# EAGLE design pimagic4 (EAGLE 7.1.0)
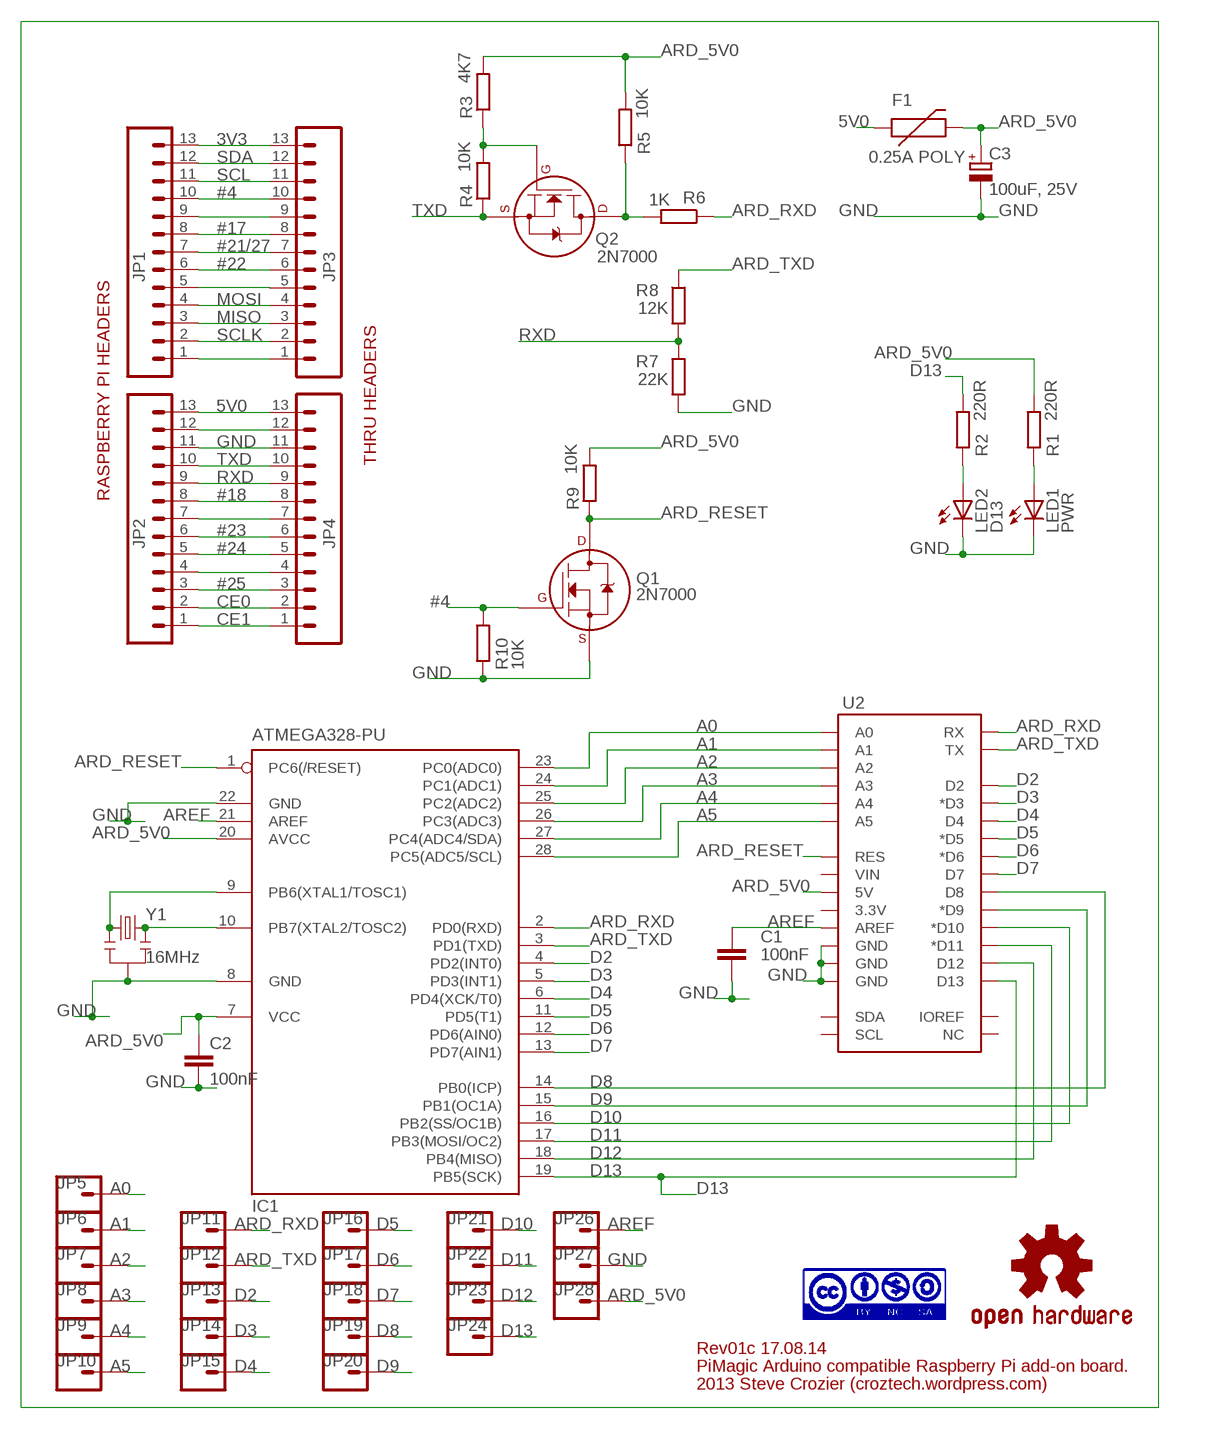
[diagram p0: schematic, sheet 1]

## Parts
C1  100nF  C5/2.5  [C5B2.5]
C2  100nF  C5/2.5  [C5B2.5]
C3  100uF, 25V  CPOL-EUE2.5-6  [E2,5-6]
F1  0.25A POLY  PTCPTH  [PTC]
IC1  ATMEGA328-PU  MEGA8-P  [DIL28-3]
JP1  M13  [1X13]
JP2  M13  [1X13]
JP3  M13  [1X13]
JP4  M13  [1X13]
JP5  M01PTH  [1X01]
JP6  M01PTH  [1X01]
JP7  M01PTH  [1X01]
JP8  M01PTH  [1X01]
JP9  M01PTH  [1X01]
JP10  M01PTH  [1X01]
JP11  M01PTH  [1X01]
JP12  M01PTH  [1X01]
JP13  M01PTH  [1X01]
JP14  M01PTH  [1X01]
JP15  M01PTH  [1X01]
JP16  M01PTH  [1X01]
JP17  M01PTH  [1X01]
JP18  M01PTH  [1X01]
JP19  M01PTH  [1X01]
JP20  M01PTH  [1X01]
JP21  M01PTH  [1X01]
JP22  M01PTH  [1X01]
JP23  M01PTH  [1X01]
JP24  M01PTH  [1X01]
JP26  M01PTH  [1X01]
JP27  M01PTH  [1X01]
JP28  M01PTH  [1X01]
LED1  PWR  LED3MM  [LED3MM]
LED2  D13  LED3MM  [LED3MM]
Q1  2N7000  2N7000_TO92  [TO-92]
Q2  2N7000  2N7000_TO92  [TO-92]
R1  220R  R-EU_0207/10  [0207/10]
R2  220R  R-EU_0207/10  [0207/10]
R3  4K7  R-EU_0207/10  [0207/10]
R4  10K  R-EU_0207/10  [0207/10]
R5  10K  R-EU_0207/10  [0207/10]
R6  1K  R-EU_0207/10  [0207/10]
R7  22K  R-EU_0207/10  [0207/10]
R8  12K  R-EU_0207/10  [0207/10]
R9  10K  R-EU_0207/10  [0207/10]
R10  10K  R-EU_0207/10  [0207/10]
U2  ARDUINO_SHIELDLONGPADS  [DUEMILANOVE_SHIELD_LONGPADS]
U$1  OSHW-LOGOM  [OSHW-LOGO-M]
Y1  16MHz  RESONATORPTH  [RESONATOR-PTH]

## Nets
3V3: JP1.13 JP3.13
5V0: F1.P$1 JP2.13 JP4.13
#4: JP1.10 JP3.10 Q1.2(G) R10.2
#17: JP1.8 JP3.8
#18: JP2.8 JP4.8
#21/27: JP1.7 JP3.7
#22: JP1.6 JP3.6
#23: JP2.6 JP4.6
#24: JP2.5 JP4.5
#25: JP2.3 JP4.3
A0: IC1.23(PC0(ADC0)) JP5.1 U2.A0
A1: IC1.24(PC1(ADC1)) JP6.1 U2.A1
A2: IC1.25(PC2(ADC2)) JP7.1 U2.A2
A3: IC1.26(PC3(ADC3)) JP8.1 U2.A3
A4: IC1.27(PC4(ADC4/SDA)) JP9.1 U2.A4
A5: IC1.28(PC5(ADC5/SCL)) JP10.1 U2.A5
ARD_5V0: C2.1 C3.+ F1.P$2 IC1.7(VCC) IC1.20(AVCC) JP28.1 R1.2 R3.2 R5.2 R9.2 U2.5V
ARD_RESET: IC1.1(PC6(/RESET)) Q1.3(D) R9.1 U2.RES
ARD_RXD: IC1.2(PD0(RXD)) JP11.1 R6.1 U2.RX
ARD_TXD: IC1.3(PD1(TXD)) JP12.1 R8.1 U2.TX
AREF: C1.1 IC1.21(AREF) JP26.1 U2.AREF
CE0: JP2.2 JP4.2
CE1: JP2.1 JP4.1
D2: IC1.4(PD2(INT0)) JP13.1 U2.D2
D3: IC1.5(PD3(INT1)) JP14.1 U2.D3(*D3)
D4: IC1.6(PD4(XCK/T0)) JP15.1 U2.D4
D5: IC1.11(PD5(T1)) JP16.1 U2.D5(*D5)
D6: IC1.12(PD6(AIN0)) JP17.1 U2.D6(*D6)
D7: IC1.13(PD7(AIN1)) JP18.1 U2.D7
D8: IC1.14(PB0(ICP)) JP19.1 U2.D8
D9: IC1.15(PB1(OC1A)) JP20.1 U2.D9(*D9)
D10: IC1.16(PB2(SS/OC1B)) JP21.1 U2.D10(*D10)
D11: IC1.17(PB3(MOSI/OC2)) JP22.1 U2.D11(*D11)
D12: IC1.18(PB4(MISO)) JP23.1 U2.D12
D13: IC1.19(PB5(SCK)) JP24.1 R2.2 U2.D13
GND: C1.2 C2.2 C3.- IC1.8(GND) IC1.22(GND) JP2.11 JP4.11 JP27.1 LED1.K(C) LED2.K(C) Q1.1(S) R7.2 R10.1 U2.GND@0(GND) U2.GND@1(GND) U2.GND@2(GND) Y1.2
MISO: JP1.3 JP3.3
MOSI: JP1.4 JP3.4
N$1: JP1.5 JP3.5
N$2: JP1.1 JP3.1
N$3: Q2.2(G) R3.1 R4.2
N$4: IC1.9(PB6(XTAL1/TOSC1)) Y1.1
N$5: JP1.9 JP3.9
N$6: IC1.10(PB7(XTAL2/TOSC2)) Y1.3
N$7: Q2.3(D) R5.1 R6.2
N$10: LED2.A R2.1
N$12: LED1.A R1.1
N$15: JP2.12 JP4.12
N$20: JP2.7 JP4.7
N$23: JP2.4 JP4.4
RXD: JP2.9 JP4.9 R7.1 R8.2
SCL: JP1.11 JP3.11
SCLK: JP1.2 JP3.2
SDA: JP1.12 JP3.12
TXD: JP2.10 JP4.10 Q2.1(S) R4.1
Unconnected: U2.3.3V U2.IOREF U2.NC U2.SCL U2.SDA U2.VIN

## Notes on the sheet
- THRU HEADERS
- RASPBERRY PI HEADERS
- Rev01c 17.08.14
- PiMagic Arduino compatible Raspberry Pi add-on board.
- 2013 Steve Crozier (croztech.wordpress.com)

## Library data of the parts
C1 C2 = capacitor-wima:C: CAPACITOR naming: grid - package width
C3 = resistor:CPOL-EU: POLARIZED CAPACITOR, European symbol
F1 = SparkFun:PTC: Resettable Fuse PTC Resettable Fuse. Spark Fun Electronics SKU : COM-08357
IC1 = atmel:MEGA8-P: MICROCONTROLLER 8 Kbytes FLASH, 1 kbytes SRAM, 512 bytes EEPROM, USART, 4-channel 10 bit ADC, 2-channel 8 bit ADC Pin compatible with Atmega48, ATMega88, ATMega168 Source: avr.lbr; OC_FARNELL: unknown; OC_NEWARK: unknown
JP1-JP4 = SparkFun:M13
JP5-JP24 JP26-JP28 = Steve01:M01: Header 1 Standard 1-pin 0.1" header. Use with straight break away headers (SKU : PRT-00116), right angle break away headers (PRT-00553), swiss pins (PRT-00743), machine pins (PRT-00117), and female headers (PRT-00115).
LED1 LED2 = SparkFun:LED: LEDs Standard schematic elements and footprints for 5mm, 3mm, 1206, and 0603 sized LEDs. 5mm - Spark Fun Electronics SKU : COM-00529 (and others)
Q1 Q2 = transistors:2N700*: 2N7000, 2N7002, NDS7002A N-channel enhancement mode MOSFET
R1-R10 = resistor:R-EU_: RESISTOR, European symbol
U2 = Steve01:ARDUINO_SHIELD: Steve's arduino shield layout: - external legends so internal second pads can be added, - long pads, added unused terminals
U$1 = SparkFun:OSHW-LOGO: Open Source Hardware Logo This logo indicates the piece of hardware it is found on incorporates a OSHW license and/or adheres to the definition of open source hardware found here: http://freedomdefined.org/OSHW
Y1 = SparkFun:RESONATOR: Resonator Small SMD resonator. This is the itty bitty 10/20MHz resonators with built in caps. CSTCE10M0G55 and CSTCE20M0V53. Footprint has been reviewed closely but hasn't been tested yet.

## Board
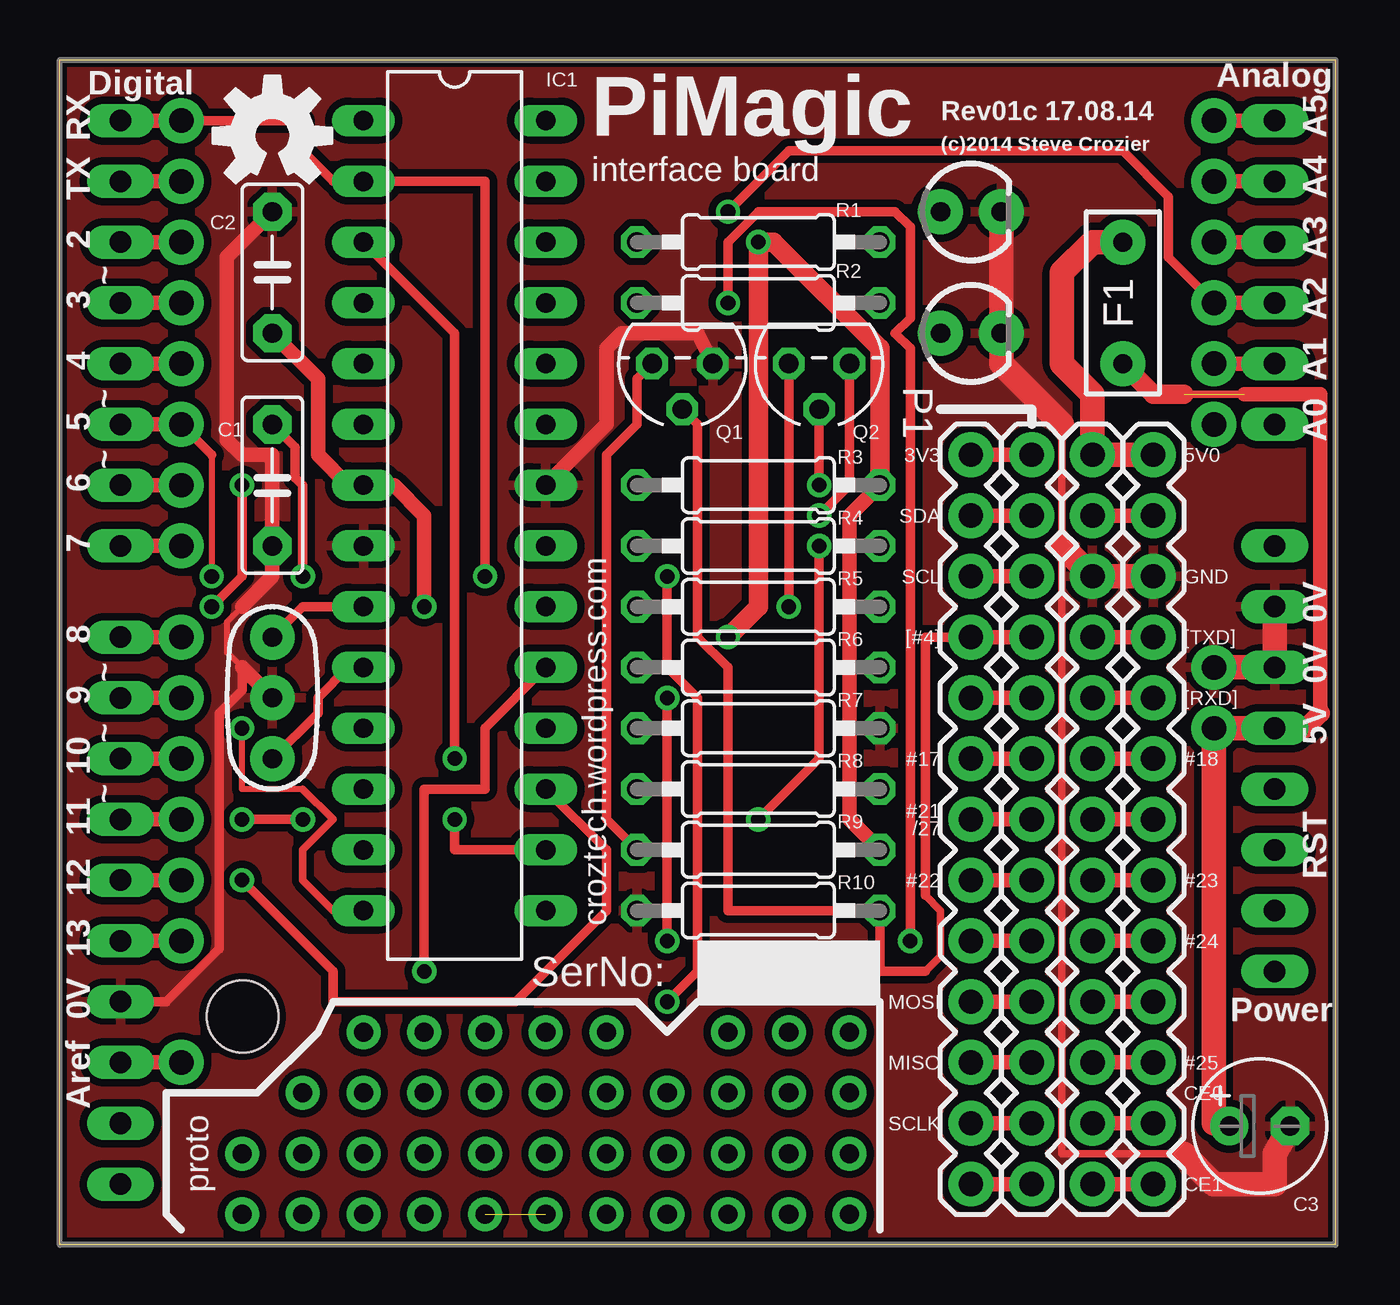
[diagram p1: board, top side]
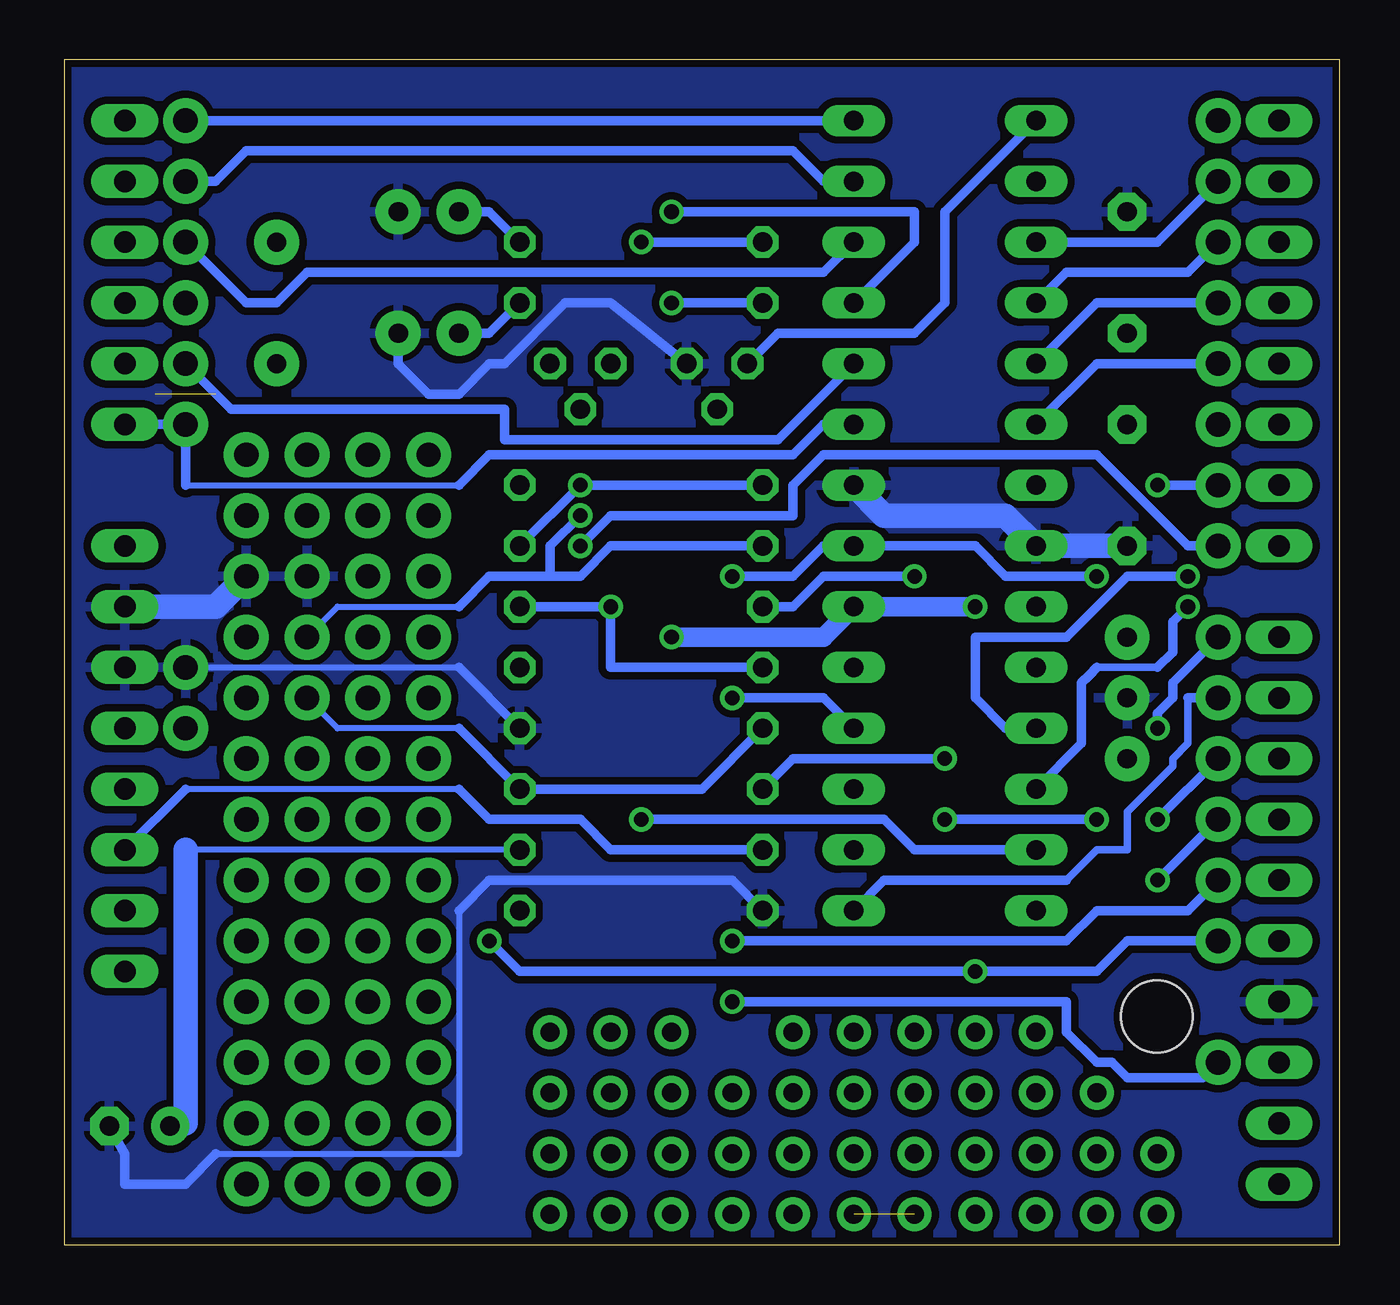
[diagram p2: board, bottom side, seen from below]

Size 53.34 x 49.53 mm. Coordinates in mm from the lower left corner, seen from the top.
Outline: 0,49.53 53.34,49.53 53.34,0 0,0 0,49.53
Copper layers (1*16): Top 0.035mm / dielectric 1.5mm / Bottom 0.035mm
Design rules "default *": minimum track width 6mil, minimum drill 20mil, track to track 6mil, track to pad 6mil, pad to pad 6mil, via to via 6mil, smd to smd 6mil, copper to edge 6mil, drill to drill 6mil, minimum pad ring 10mil, minimum via ring 8mil, stop-mask expansion 4mil, vias tented up to drill 0mil, thermal gap 10mil
Holes 3 mm at 7.64,9.54

### Footprints (pad centres in the part's own frame; a part is rotated, then mirrored left to right if it is on the bottom)
C5B2.5 = drill 0.813 pad 1.6 octagon: 1 -2.54,0; 2 2.54,0
E2,5-6 = drill 0.813 pad 1.6: + -1.27,0 | drill 0.813 pad 1.6 octagon: - 1.27,0
PTC = drill 0.8 pad 1.88: P$1 -2.54,0; P$2 2.54,0
DIL28-3 = drill 0.813 long: 1 -16.51,-3.81; 2 -13.97,-3.81; 3 -11.43,-3.81; 4 -8.89,-3.81; 5 -6.35,-3.81; 6 -3.81,-3.81; 7 -1.27,-3.81; 8 1.27,-3.81; 9 3.81,-3.81; 10 6.35,-3.81; 11 8.89,-3.81; 12 11.43,-3.81; 13 13.97,-3.81; 14 16.51,-3.81; 15 16.51,3.81; 16 13.97,3.81; 17 11.43,3.81; 18 8.89,3.81; 19 6.35,3.81; 20 3.81,3.81; 21 1.27,3.81; 22 -1.27,3.81; 23 -3.81,3.81; 24 -6.35,3.81; 25 -8.89,3.81; 26 -11.43,3.81; 27 -13.97,3.81; 28 -16.51,3.81
1X13 = drill 1.016 pad 1.88: 1 0,0; 2 2.54,0; 3 5.08,0; 4 7.62,0; 5 10.16,0; 6 12.7,0; 7 15.24,0; 8 17.78,0; 9 20.32,0; 10 22.86,0; 11 25.4,0; 12 27.94,0; 13 30.48,0
1X01 = drill 1.016 pad 1.88: 1 0,0
LED3MM = drill 0.813 pad 1.88: A -1.27,0; K 1.27,0
TO-92 = drill 0.813 octagon: 1 -1.27,0; 2 0,1.905; 3 1.27,0
0207/10 = drill 0.813 octagon: 1 -5.08,0; 2 5.08,0
DUEMILANOVE_SHIELD_LONGPADS = drill 0.9 pad 1.27 long: 3.3V 50.8,26.67; 5V 50.8,29.21; A0 50.8,41.91; A1 50.8,44.45; A2 50.8,46.99; A3 50.8,49.53; A4 50.8,52.07; A5 50.8,54.61; AREF 2.54,15.24; D2 2.54,49.53; D3 2.54,46.99; D4 2.54,44.45; D5 2.54,41.91; D6 2.54,39.37; D7 2.54,36.83; D8 2.54,33.02; D9 2.54,30.48; D10 2.54,27.94; D11 2.54,25.4; D12 2.54,22.86; D13 2.54,20.32; GND@0 50.8,31.75; GND@1 50.8,34.29; GND@2 2.54,17.78; IOREF 50.8,21.59; NC 50.8,19.05; RES 50.8,24.13; RX 2.54,54.61; SCL 2.54,10.16; SDA 2.54,12.7; TX 2.54,52.07; VIN 50.8,36.83
RESONATOR-PTH = drill 0.8 pad 1.88: 1 -2.54,0; 2 0,0; 3 2.54,0

### Placement (x,y rotation side)
C1  8.89,31.75 270 top
C2  8.89,40.64 90 top
C3  50.17,4.96 0 top
F1  44.45,39.37 270 top
IC1  16.51,30.48 270 top
JP1  40.64,2.54 90 top
JP2  43.18,2.54 90 top
JP3  38.1,2.54 90 top
JP4  45.72,2.54 90 top
JP5  48.26,34.29 0 top
JP6  48.26,36.83 0 top
JP7  48.26,39.37 0 bottom
JP8  48.26,41.91 0 top
JP9  48.26,44.45 0 top
JP10  48.26,46.99 0 top
JP11  5.08,46.99 0 top
JP12  5.08,44.45 0 top
JP13  5.08,41.91 0 top
JP14  5.08,39.37 0 top
JP15  5.08,36.83 0 top
JP16  5.08,34.29 0 top
JP17  5.08,31.75 0 top
JP18  5.08,29.21 0 top
JP19  5.08,25.4 0 top
JP20  5.08,22.86 0 top
JP21  5.08,20.32 0 top
JP22  5.08,17.78 0 top
JP23  5.08,15.24 0 top
JP24  5.08,12.7 0 top
JP26  5.08,7.62 0 top
JP27  48.26,24.13 0 top
JP28  48.26,21.59 0 top
LED1  38.1,43.18 0 top
LED2  38.1,38.1 0 top
Q1  26.04,36.83 180 top
Q2  31.75,36.83 180 top
R1  29.21,41.91 180 top
R2  29.21,39.37 180 top
R3  29.21,31.75 0 top
R4  29.21,29.21 0 top
R5  29.21,24.13 0 top
R6  29.21,26.67 0 top
R7  29.21,21.59 0 top
R8  29.21,19.05 0 top
R9  29.21,16.51 0 top
R10  29.21,13.97 0 top
U2  0,-7.62 0 top
U$1  8.89,46.35 0 top
Y1  8.89,22.86 270 top

### Tracks (layer width: path | path; a pad name or v marks a point on that pad's centre or on a via)
3V3
  Top 0.61: JP3.13 JP1.13
5V0
  Top 1.016: JP4.13 JP2.13 43.18,35.56 41.91,36.83 41.91,40.64 43.18,41.91 F1.P$1
#4
  Top 0.305: 36.2,11.43 36.83,12.06 36.83,13.97 36.2,14.6
  Top 0.406: 26.67,34.29 26.67,33.02 26.67,25.4 27.94,24.13 27.94,13.97 R10.2 34.29,11.43 36.2,11.43 | 26.67,34.29 Q1.2 26.67,34.29 | 36.2,14.6 36.2,25.4 JP3.10
  Top 0.61: JP1.10 JP3.10
#17
  Top 0.61: JP1.8 JP3.8
#18
  Top 0.61: JP2.8 JP4.8
#21/27
  Top 0.61: JP3.7 JP1.7
#22
  Top 0.61: JP1.6 JP3.6
#23
  Top 0.61: JP2.6 JP4.6
#24
  Top 0.61: JP4.5 JP2.5
#25
  Top 0.61: JP4.3 JP2.3
A0
  Bottom 0.254: 48.26,31.75 36.83,31.75
  Bottom 0.406: IC1.23 21.59,34.29 22.86,33.02 35.56,33.02 36.83,31.75 | 48.26,31.75 JP5.1 U2.A0
A1
  Top 0.61: U2.A1 JP6.1
  Bottom 0.406: IC1.24 23.5,33.66 34.92,33.66 34.92,34.93 46.35,34.93 JP6.1
A2  (via drill 0.61)
  Top 0.406: JP7.1 46.35,41.27 46.35,43.82 44.45,45.72 30.48,45.72 v27.94,43.18
  Top 0.61: U2.A2 JP7.1
  Bottom 0.406: v27.94,43.18 17.78,43.18 17.78,41.91 IC1.25
A3
  Top 0.61: U2.A3 JP8.1
  Bottom 0.406: IC1.26 21.59,40.64 43.18,40.64 44.45,39.37 45.72,39.37 JP8.1
A4
  Top 0.61: U2.A4 JP9.1
  Bottom 0.406: IC1.27 21.59,44.45 22.86,45.72 45.72,45.72 46.99,44.45 JP9.1
A5
  Top 0.61: U2.A5 JP10.1
  Bottom 0.406: IC1.28 JP10.1
ARD_5V0  (via drill 0.61)  (1 unrouted)
  Top 0.305: 46.99,35.56 49.53,35.56
  Top 0.61: C2.1 10.79,36.2 10.79,33.02 12.07,31.75 IC1.7 13.97,31.75 15.24,30.48 v15.24,26.67 | R9.2 33.02,17.78 33.02,24.13 | 33.02,24.13 R5.2 | 33.02,24.13 33.02,30.48 R3.2 | 49.53,35.56 52.7,35.56 52.7,22.23
  Top 0.813: JP28.1 52.07,21.59 52.7,22.23 | F1.P$2 45.72,35.56 46.99,35.56 | v27.94,25.4 29.21,26.67 v29.21,41.91 29.84,41.91 34.29,37.46 R3.2
  Top 1.016: C3.+ 48.26,5.08 JP28.1 U2.5V
  Bottom 0.254: R9.2 48.26,16.51
  Bottom 0.406: R1.2 v29.21,41.91
  Bottom 0.813: v27.94,25.4 21.59,25.4 IC1.20 v15.24,26.67
  Bottom 1.016: 48.26,16.51 48.26,5.08 C3.+
ARD_RESET
  Top 0.406: R9.1 22.86,17.78 22.86,33.02 24.13,34.29 24.13,36.2 Q1.3
  Bottom 0.254: 36.83,19.05 48.26,19.05
  Bottom 0.406: IC1.1 16.51,43.18 16.51,39.37 17.78,38.1 21.59,38.1 23.5,38.1 Q1.3 | 48.26,19.05 U2.RES | 36.83,19.05 35.56,17.78 31.75,17.78 30.48,16.51 R9.1
ARD_RXD  (via drill 0.61)
  Top 0.406: JP11.1 10.16,46.99 10.16,45.72 11.43,44.45 IC1.2 17.78,44.45 v17.78,27.94
  Top 0.61: U2.RX JP11.1
  Bottom 0.406: R6.1 22.86,26.67 21.59,27.94 v17.78,27.94
ARD_TXD  (via drill 0.61)
  Top 0.406: IC1.3 16.51,38.1 v16.51,20.32
  Top 0.61: JP12.1 U2.TX
  Bottom 0.406: JP12.1 7.62,41.91 IC1.3 | v16.51,20.32 22.86,20.32 R8.1
AREF  (via drill 0.61)
  Top 0.406: v25.4,10.16 26.67,11.43 26.67,22.86 25.4,24.13 v25.4,27.94 | C1.1 9.84,33.34 9.84,32.07 10.16,31.75 v10.16,27.94
  Top 0.61: U2.AREF JP26.1
  Bottom 0.406: v25.4,10.16 11.43,10.16 11.43,8.89 10.16,7.62 9.53,7.62 8.89,6.98 5.71,6.98 JP26.1 | v25.4,27.94 22.86,27.94 21.59,29.21 IC1.21 15.24,29.21 13.97,27.94 v10.16,27.94
CE0
  Top 0.61: JP2.2 JP4.2
CE1
  Top 0.61: JP4.1 JP2.1
D2
  Top 0.61: U2.D2 JP13.1
  Bottom 0.406: JP13.1 6.35,40.64 11.43,40.64 IC1.4
D3
  Top 0.61: JP14.1 U2.D3
  Bottom 0.406: JP14.1 10.16,39.37 IC1.5
D4
  Top 0.61: U2.D4 JP15.1
  Bottom 0.406: JP15.1 10.16,36.83 IC1.6
D5  (via drill 0.61)
  Top 0.254: 6.35,33.02 v6.35,27.94
  Top 0.406: 6.35,33.02 JP16.1
  Top 0.61: JP16.1 U2.D5
  Bottom 0.406: v6.35,27.94 8.89,27.94 11.43,25.4 15.24,25.4 15.24,22.86 13.97,21.59 IC1.11
D6  (via drill 0.61)
  Top 0.406: v6.35,26.67 7.62,27.94 v7.62,31.75
  Top 0.61: U2.D6 JP17.1
  Bottom 0.305: 7.62,24.13 10.16,24.13
  Bottom 0.406: JP17.1 v7.62,31.75 | IC1.12 10.79,20.95 10.79,23.49 10.48,23.81 10.16,24.13 | 7.62,24.13 6.99,24.77 6.99,26.03 v6.35,26.67
D7  (via drill 0.61)
  Top 0.406: v29.21,17.78 31.75,20.32 v31.75,29.21
  Top 0.61: JP18.1 U2.D7
  Bottom 0.406: v31.75,29.21 30.48,30.48 22.86,30.48 22.86,31.75 21.59,33.02 10.16,33.02 6.35,29.21 JP18.1 | IC1.13 17.78,16.51 19.05,17.78 v29.21,17.78
D8  (via drill 0.61)
  Top 0.254: 10.16,19.05 7.62,19.05 v7.62,21.59
  Top 0.305: IC1.14 11.43,13.97 10.16,15.24 10.16,16.51 11.43,17.78 10.16,19.05
  Top 0.61: U2.D8 JP19.1
  Bottom 0.406: v7.62,21.59 7.62,22.23 6.99,22.86 6.99,23.49 JP19.1
D9
  Top 0.61: JP20.1 U2.D9
  Bottom 0.305: 6.35,22.86 6.35,20.95 6.99,20.32 6.99,20 8.89,18.1 8.89,16.51 10.16,16.51 11.43,15.24
  Bottom 0.406: IC1.15 19.05,15.24 11.43,15.24 | 6.35,22.86 JP20.1
D10  (via drill 0.61)
  Top 0.406: v16.51,17.78 16.51,16.51 IC1.16 | v7.62,17.78 v10.16,17.78
  Top 0.61: U2.D10 JP21.1
  Bottom 0.406: JP21.1 v7.62,17.78 | v10.16,17.78 v16.51,17.78
D11  (via drill 0.61)
  Top 0.406: IC1.17 22.86,16.51 22.86,13.97 19.05,10.16 11.43,10.16 11.43,11.43 v7.62,15.24
  Top 0.61: JP22.1 U2.D11
  Bottom 0.406: JP22.1 v7.62,15.24
D12  (via drill 0.61)
  Top 0.406: v25.4,12.7 v25.4,22.86
  Top 0.61: U2.D12 JP23.1
  Bottom 0.406: IC1.18 21.59,22.86 v25.4,22.86 | JP23.1 6.35,13.97 10.16,13.97 11.43,12.7 v25.4,12.7
D13  (via drill 0.61)
  Top 0.406: IC1.19 17.78,21.59 17.78,19.05 15.24,19.05 v15.24,11.43 | v27.94,39.37 27.94,41.91 29.21,43.18 34.92,43.18 35.56,42.54 35.56,38.73 34.92,38.1 35.56,37.46 v35.56,12.7
  Top 0.61: JP24.1 U2.D13
  Bottom 0.406: v35.56,12.7 34.29,11.43 v15.24,11.43 10.16,11.43 8.89,12.7 JP24.1 | R2.2 v27.94,39.37
GND
  Top 0.254: 7.62,26.67 6.99,26.03 6.99,24.77 7.62,24.13
  Top 0.305: 41.91,34.29 41.91,29.21 41.91,3.81 46.99,3.81
  Top 0.406: U2.GND@2 4.45,10.16 6.67,12.38 6.67,22.23 7.62,23.18 7.62,24.13
  Top 0.61: C2.2 6.99,41.27 6.99,33.66 7.62,33.02 8.89,33.02 C1.2 8.89,27.94 7.62,26.67 | 7.62,24.13 Y1.2 | IC1.22 22.86,34.29 22.86,37.46 23.5,38.1 26.67,38.1 Q1.1
  Top 1.016: JP27.1 U2.GND@0 U2.GND@1 | JP4.11 JP2.11 41.91,29.21 | 41.91,34.29 39.37,36.83 LED2.K LED1.K | 46.99,3.81 48.26,2.54 50.8,2.54 50.8,3.81 C3.-
  Bottom 0.254: 46.99,3.81 36.83,3.81 36.83,13.97 | JP27.1 36.83,24.13
  Bottom 0.406: LED2.K 39.37,36.83 38.1,35.56 36.83,35.56 35.56,36.83 34.92,36.83 32.38,39.37 30.48,39.37 Q1.1 | R7.2 36.83,24.13 | 46.99,3.81 48.26,2.54 50.8,2.54 50.8,3.81 C3.- | R10.1 25.4,15.24 35.56,15.24 36.83,13.97
  Bottom 1.016: U2.GND@1 46.99,26.67 JP4.11 | C1.2 IC1.8 13.97,30.48 19.05,30.48 IC1.22
  pour Top (isolate 0.305): 0,49.53 53.34,49.53 53.34,0 0,0
  pour Bottom (isolate 0.305): 0,49.53 53.34,49.53 53.34,0 0,0
MISO
  Top 0.61: JP3.3 JP1.3
MOSI
  Top 0.61: JP1.4 JP3.4
N$1
  Top 0.61: JP3.5 JP1.5
N$2
  Top 0.61: JP3.1 JP1.1
N$3  (via drill 0.61)
  Top 0.406: Q2.2 v31.75,31.75
  Bottom 0.406: R4.2 v31.75,31.75 R3.1
N$4
  Top 0.406: Y1.1 10.16,26.67 IC1.9
N$5
  Top 0.61: JP3.9 JP1.9
N$6
  Top 0.406: Y1.3 10.79,22.23 10.79,22.86 12.07,24.13 IC1.10
N$7  (via drill 0.61)
  Top 0.406: Q2.3 v30.48,26.67
  Bottom 0.406: R5.1 30.48,24.13 v30.48,26.67 R6.2
N$8  (via drill 0.8 pad 1.42)
  other vias: 25.4,3.81
N$9  (via drill 0.8 pad 1.42)  (1 unrouted)
  other vias: 20.32,1.27 17.78,1.27
N$10
  Bottom 0.406: R2.1 35.56,38.1 LED2.A
N$11  (via drill 0.8 pad 1.42)
  other vias: 10.16,3.81
N$12
  Bottom 0.406: R1.1 35.56,43.18 LED1.A
N$13  (via drill 0.8 pad 1.42)
  other vias: 7.62,3.81
N$15
  Top 0.61: JP2.12 JP4.12
N$16  (via drill 0.8 pad 1.42)
  other vias: 7.62,1.27
N$17  (via drill 0.8 pad 1.42)
  other vias: 10.16,1.27
N$19  (via drill 0.8 pad 1.42)
  other vias: 10.16,6.35
N$20
  Top 0.61: JP4.7 JP2.7
N$21  (via drill 0.8 pad 1.42)
  other vias: 12.7,6.35
N$22  (via drill 0.8 pad 1.42)
  other vias: 12.7,8.89
N$23
  Top 0.61: JP2.4 JP4.4
N$24  (via drill 0.8 pad 1.42)
  other vias: 15.24,8.89
N$25  (via drill 0.8 pad 1.42)
  other vias: 17.78,8.89
N$26  (via drill 0.8 pad 1.42)
  other vias: 20.32,8.89
N$27  (via drill 0.8 pad 1.42)
  other vias: 22.86,8.89
N$28  (via drill 0.8 pad 1.42)
  other vias: 20.32,6.35
N$29  (via drill 0.8 pad 1.42)
  other vias: 22.86,6.35
N$30  (via drill 0.8 pad 1.42)
  other vias: 25.4,6.35
N$31  (via drill 0.8 pad 1.42)
  other vias: 27.94,6.35
N$32  (via drill 0.8 pad 1.42)
  other vias: 30.48,6.35
N$33  (via drill 0.8 pad 1.42)
  other vias: 30.48,8.89
N$34  (via drill 0.8 pad 1.42)
  other vias: 33.02,8.89
N$35  (via drill 0.8 pad 1.42)
  other vias: 27.94,8.89
N$36  (via drill 0.8 pad 1.42)
  other vias: 33.02,6.35
N$37  (via drill 0.8 pad 1.42)
  other vias: 33.02,1.27
N$38  (via drill 0.8 pad 1.42)
  other vias: 33.02,3.81
N$39  (via drill 0.8 pad 1.42)
  other vias: 30.48,1.27
N$40  (via drill 0.8 pad 1.42)
  other vias: 30.48,3.81
N$41  (via drill 0.8 pad 1.42)
  other vias: 27.94,1.27
N$42  (via drill 0.8 pad 1.42)
  other vias: 27.94,3.81
N$43  (via drill 0.8 pad 1.42)
  other vias: 25.4,1.27
N$44  (via drill 0.8 pad 1.42)
  other vias: 22.86,1.27
N$45  (via drill 0.8 pad 1.42)
  other vias: 20.32,3.81
N$46  (via drill 0.8 pad 1.42)
  other vias: 15.24,1.27
N$47  (via drill 0.8 pad 1.42)
  other vias: 12.7,1.27
N$48  (via drill 0.8 pad 1.42)
  other vias: 12.7,3.81
N$49  (via drill 0.8 pad 1.42)
  other vias: 15.24,3.81
N$50  (via drill 0.8 pad 1.42)
  other vias: 17.78,3.81
N$51  (via drill 0.8 pad 1.42)
  other vias: 17.78,6.35
N$52  (via drill 0.8 pad 1.42)
  other vias: 15.24,6.35
N$53  (via drill 0.8 pad 1.42)
  other vias: 22.86,3.81
RXD
  Top 0.61: JP2.9 JP4.9
  Bottom 0.254: JP2.9 41.91,21.59 36.83,21.59
  Bottom 0.406: R7.1 26.67,19.05 R8.2 36.83,21.59
SCL
  Top 0.61: JP3.11 JP1.11
SCLK
  Top 0.61: JP1.2 JP3.2
SDA
  Top 0.61: JP1.12 JP3.12
TXD  (via drill 0.61)
  Top 0.406: v31.75,30.48 33.02,31.75 Q2.1
  Top 0.61: JP2.10 JP4.10
  Bottom 0.254: 36.83,26.67 41.91,26.67 JP2.10
  Bottom 0.406: R4.1 30.48,29.21 31.75,27.94 33.02,27.94 | 33.02,27.94 35.56,27.94 36.83,26.67 | v31.75,30.48 33.02,29.21 33.02,27.94

### Text on the board
tNames: PiMagic | Rev01c 17.08.14 | (c)2014 Steve Crozier | interface board | P1 | 3V3 | 5V0 | SDA | SCL | GND | [#4] | [TXD] | [RXD] | #17 | #18 | #21 / /27 | #22 | #23 | croztech.wordpress.com | #24 | SerNo: | MOSI | MISO | #25 | CE0 | SCLK | proto | CE1